# EAGLE design current_loop3 (EAGLE 6.6.0)
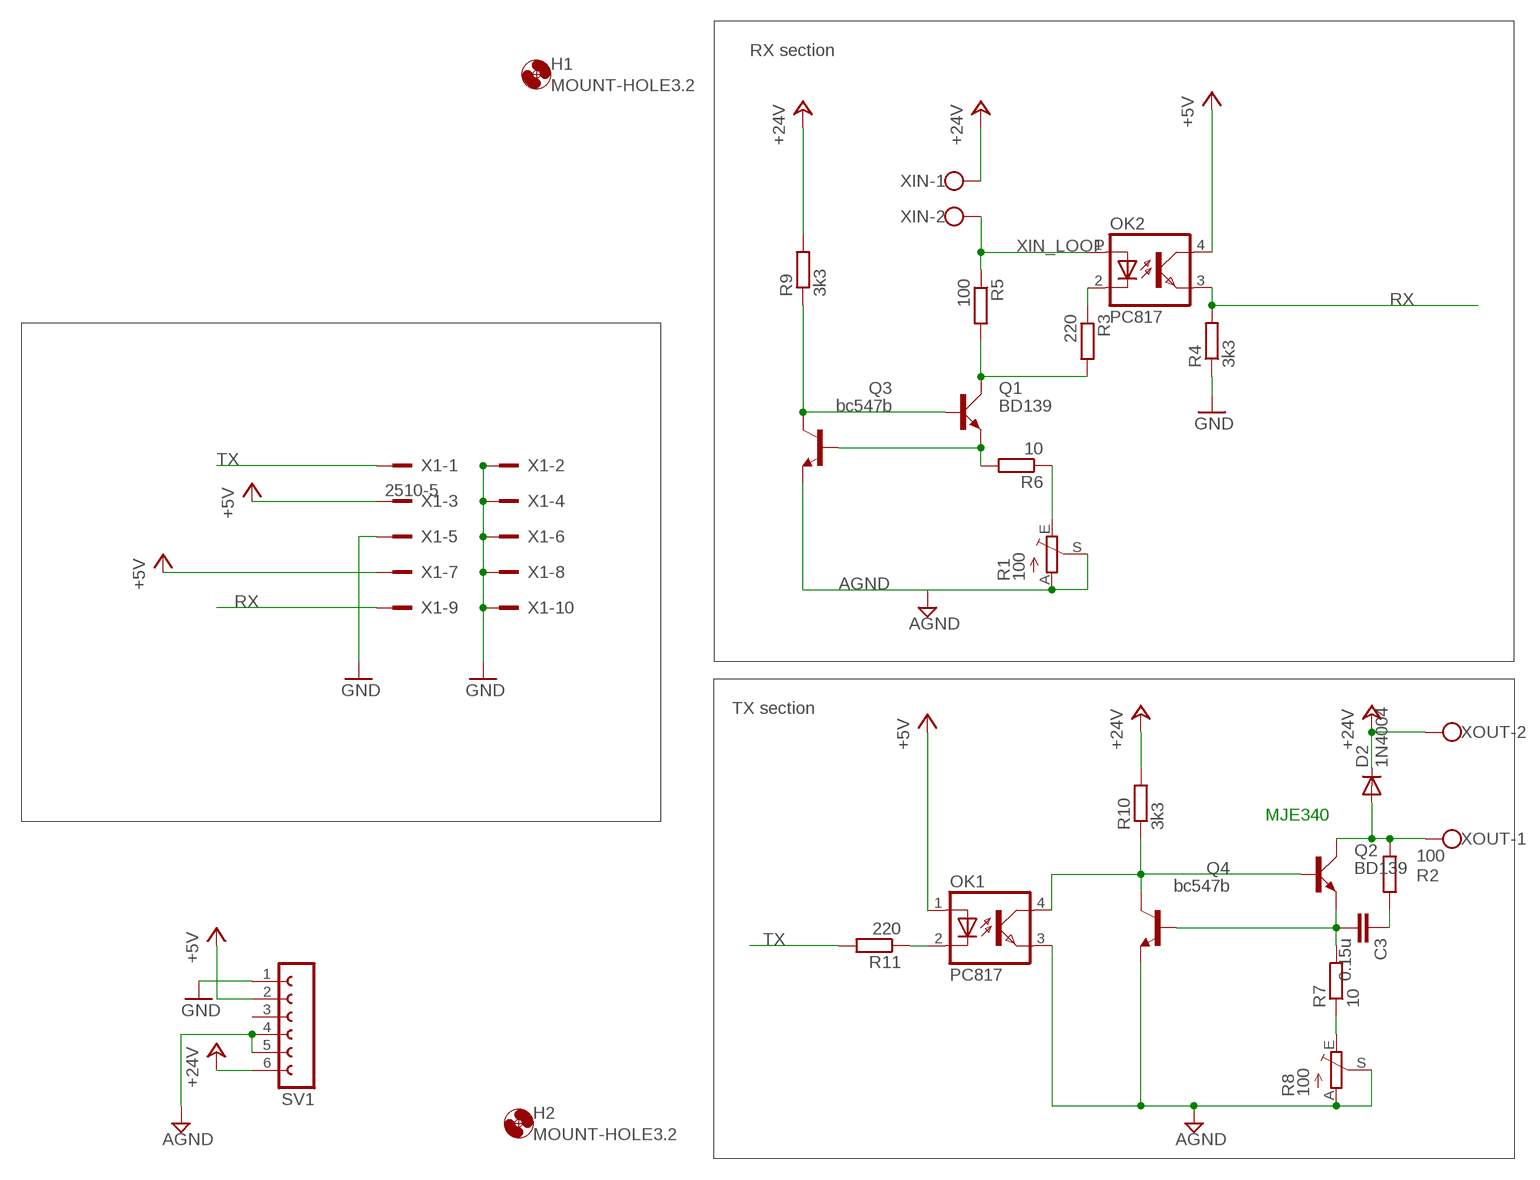
[diagram p0: schematic, sheet 1]

## Parts
C3  0.15u  C-EU075-063X106  [C075-063X106]
D2  1N4004  [DO41-10]
H1  MOUNT-HOLE3.2  [3,2]
H2  MOUNT-HOLE3.2  [3,2]
OK1  PC817  [DIL04]
OK2  PC817  [DIL04]
Q1  BD139  [TO126AV]
Q2  BD139  [TO126AV]
Q3  bc547b  BC547B-NPN-TO92-CBE  [TO92-CBE]
Q4  bc547b  BC547B-NPN-TO92-CBE  [TO92-CBE]
R1  100  TRIM_EU-CA14H  [CA14H]
R2  100  R-EU_0204/2V  [0204V]
R3  220  R-EU_0204/2V  [0204V]
R4  3k3  R-EU_0204/2V  [0204V]
R5  100  R-EU_0204/2V  [0204V]
R6  10  R-EU_0204/7  [0204/7]
R7  10  R-EU_0204/2V  [0204V]
R8  100  TRIM_EU-CA14H  [CA14H]
R9  3k3  R-EU_0204/7  [0204/7]
R10  3k3  R-EU_0204/2V  [0204V]
R11  220  R-EU_0204/2V  [0204V]
SV1  FE06-1  [FE06]
X1  2510-5  [PAK100/2500-5-10]
XIN  W237-102  [W237-102]
XOUT  W237-102  [W237-102]

## Nets
+5V: OK1.1(A) OK2.4(COL) SV1.2 X1.3 X1.7
+24V: D2.C R9.2 R10.2 SV1.6 XIN.1 XOUT.2
AGND: OK1.3(EMIT) Q3.E Q4.E R1.A R1.S R8.A R8.S SV1.4 SV1.5
GND: R4.1 SV1.1 X1.2 X1.4 X1.5 X1.6 X1.8 X1.10
N$1: Q1.C R3.2 R5.2
N$2: R7.1 R8.E
N$3: R1.E R6.1
N$4: C3.1 R2.1
N$9: OK2.2(C) R3.1
N$15: OK1.2(C) R11.1
N$16: D2.A Q2.C R2.2 XOUT.1
N$19: Q1.E Q3.B R6.2
N$20: OK1.4(COL) Q2.B Q4.C R10.1
N$24: C3.2 Q2.E Q4.B R7.2
N$25: Q1.B Q3.C R9.1
RX: OK2.3(EMIT) R4.2 X1.9
TX: R11.2 X1.1
XIN_LOOP: OK2.1(A) R5.1 XIN.2
Unconnected: SV1.3

## Notes on the sheet
- RX section
- TX section
- MJE340

## Library data of the parts
C3 = rcl:C-EU: CAPACITOR, European symbol
D2 = diode:1N4004: DIODE general purpose rectifier, 1 A
H1 H2 = holes:MOUNT-HOLE: MOUNTING HOLE with drill center marker
OK1 OK2 = optocoupler:PC817: SHARP OPTO COUPLER; MPN: PC817X4J000F; OC_FARNELL: 9707727; OC_NEWARK: 97K7059
Q1 Q2 = transistor-power:BD139: NPN TRANSISTOR
Q3 Q4 = transistor:*-NPN-: NPN Transistror BF959 corrected 2008.03.06
R1 R8 = pot:TRIM_EU-: POTENTIOMETER
R2-R7 R9-R11 = rcl:R-EU_: RESISTOR, European symbol
SV1 = con-lsta:FE06-1: FEMALE HEADER; OC_FARNELL: unknown; OC_NEWARK: unknown
X1 = con-3m:2510-: 3M (TM) Pak 100 4-Wall Header Source: 3M; OC_FARNELL: 1788669; OC_NEWARK: unknown
XIN XOUT = con-wago-500:W237-102: WAGO SCREW CLAMP; MPN: 237-102; OC_FARNELL: unknown; OC_NEWARK: 70K9898

## Board
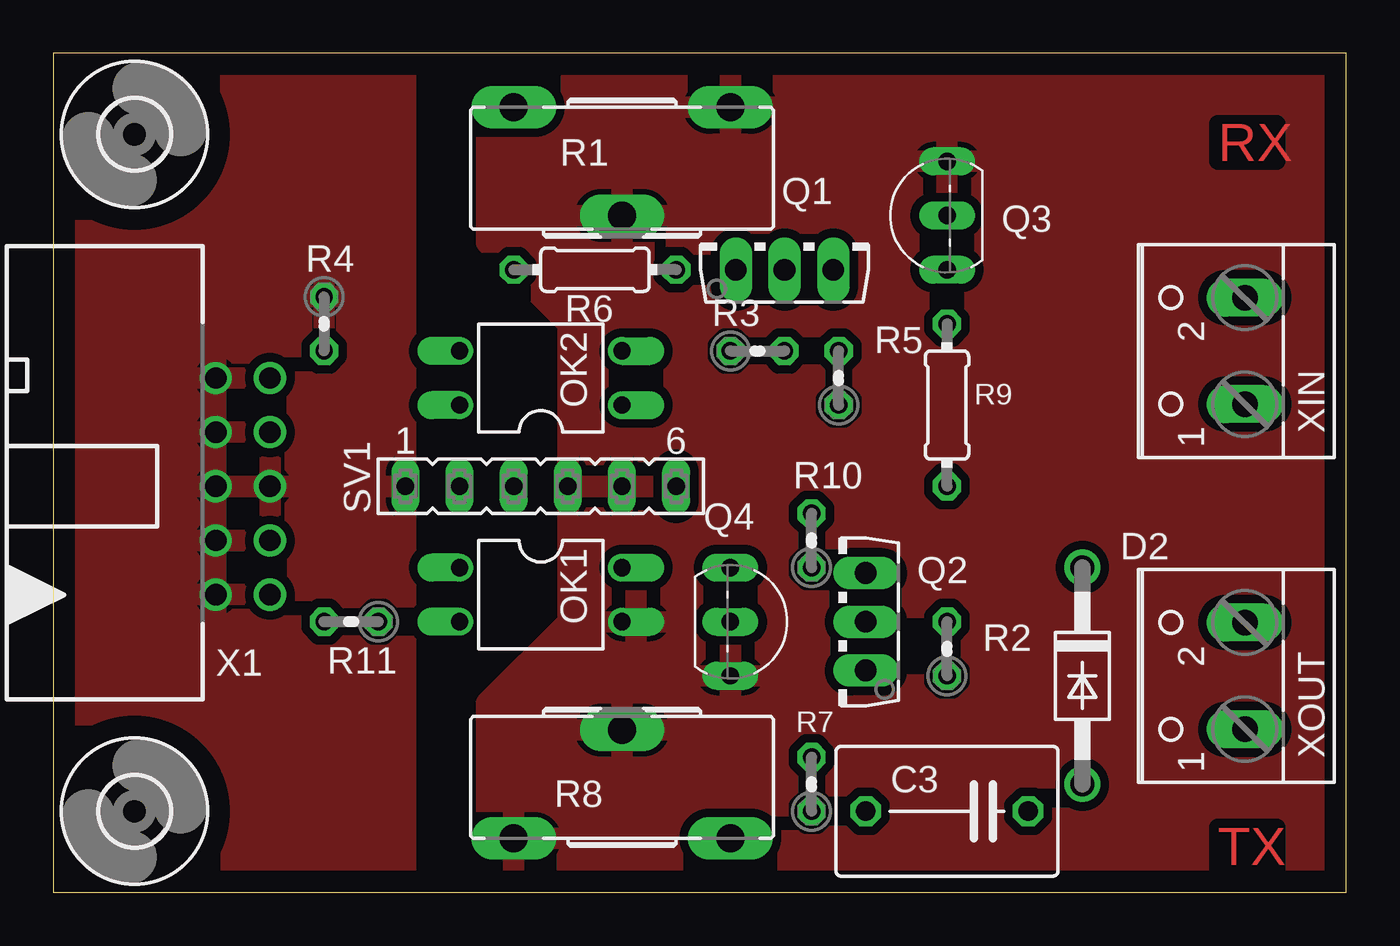
[diagram p1: board, top side]
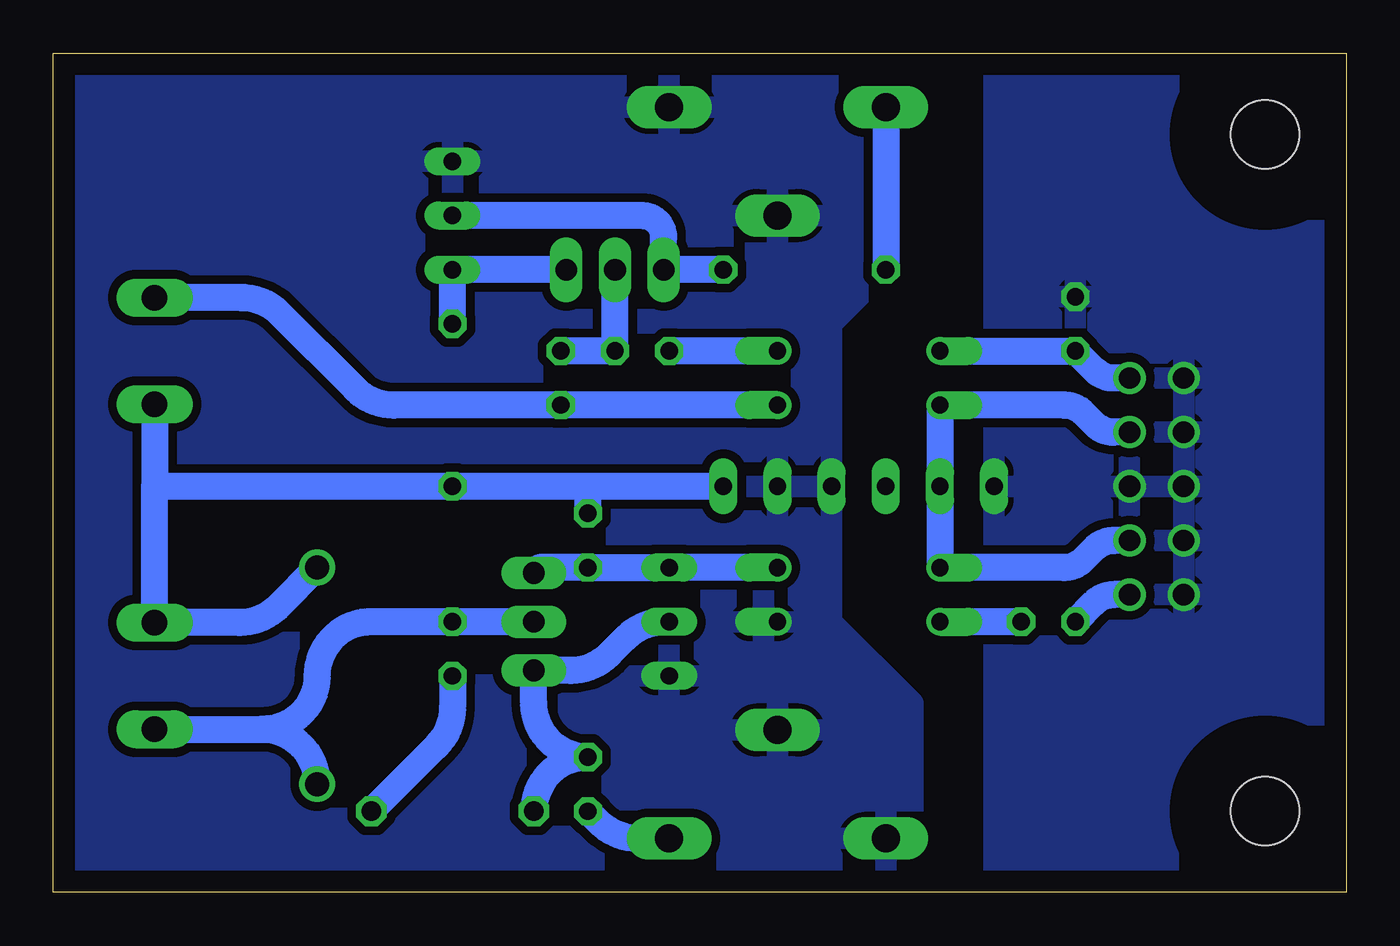
[diagram p2: board, bottom side, seen from below]

Size 60.63 x 39.36 mm. Coordinates in mm from the lower left corner, seen from the top.
Outline: 0,0 60.63,0 60.63,39.36 0,39.36 0,0
Copper layers (1*16): Top 0.035mm / dielectric 1.5mm / Bottom 0.035mm
Design rules "default": minimum track width 10mil, minimum drill 24mil, track to track 8mil, track to pad 8mil, pad to pad 8mil, via to via 8mil, smd to smd 8mil, copper to edge 40mil, drill to drill 8mil, minimum pad ring 10mil, minimum via ring 8mil, stop-mask expansion 4mil, vias tented up to drill 0mil, thermal gap 10mil

### Footprints (pad centres in the part's own frame; a part is rotated, then mirrored left to right if it is on the bottom)
C075-063X106 = drill 0.914 octagon: 1 -3.81,0; 2 3.81,0
DO41-10 = drill 1.118: A 5.08,0; C -5.08,0
3,2 = hole 3.2: 0,0
DIL04 = drill 0.813 offset: 1 -1.27,-3.81; 2 1.27,-3.81; 3 1.27,3.81; 4 -1.27,3.81
TO126AV = drill 1.016 long: B 2.286,-1.27; C 0,-1.27; E -2.286,-1.27
TO92-CBE = drill 0.813 long: B 0,0; C -2.54,0; E 2.54,0
CA14H = drill 1.321 long: A -5.08,0; E 5.08,0; S 0,5.08
0204V = drill 0.813 octagon: 1 -1.27,0; 2 1.27,0
0204/7 = drill 0.813 octagon: 1 -3.81,0; 2 3.81,0
FE06 = drill 0.813 long: 1 -6.35,0; 2 -3.81,0; 3 -1.27,0; 4 1.27,0; 5 3.81,0; 6 6.35,0
PAK100/2500-5-10 = drill 1 pad 1.422: 1 -5.08,-1.27; 2 -5.08,1.27; 3 -2.54,-1.27; 4 -2.54,1.27; 5 0,-1.27; 6 0,1.27; 7 2.54,-1.27; 8 2.54,1.27; 9 5.08,-1.27; 10 5.08,1.27
W237-102 = drill 1.194 long: 1 -2.5,-1.27; 2 2.5,-1.27

### Placement (x,y rotation side)
C3  41.91,3.81 180 top
D2  48.26,10.16 270 top
H1  3.81,3.81 0 top
H2  3.81,35.56 0 top
OK1  22.86,13.97 270 top
OK2  22.86,24.13 90 top
Q1  34.29,30.48 0 top
Q2  36.83,12.7 90 top
Q3  41.91,31.75 90 top
Q4  31.75,12.7 270 top
R1  26.67,36.83 180 top
R2  41.91,11.43 90 top
R3  33.02,25.4 0 top
R4  12.7,26.67 270 top
R5  36.83,24.13 90 top
R6  25.4,29.21 0 top
R7  35.56,5.08 90 top
R8  26.67,2.54 0 top
R9  41.91,22.86 270 top
R10  35.56,16.51 90 top
R11  13.97,12.7 180 top
SV1  22.86,19.05 0 top
X1  8.89,19.05 90 top
XIN  54.61,25.4 90 top
XOUT  54.61,10.16 90 top

### Tracks (layer width: path | path; a pad name or v marks a point on that pad's centre or on a via)
+5V
  Bottom 1.27: X1.7 10.9,21.59 arc45 11.8,21.96 12.33,22.49 arc-45 13.23,22.86 OK2.4 SV1.2 OK1.1 13.23,15.24 arc-45 12.33,15.61 11.8,16.14 arc45 10.9,16.51 X1.3
+24V
  Bottom 1.27: 55.88,19.05 R9.2 35.56,19.05 | XIN.1 55.88,19.05 | 55.88,19.05 XOUT.2 51.89,12.66 arc-45 50.1,13.4 D2.C | SV1.6 35.56,19.05 | R10.2 35.56,19.05
AGND
  pour Bottom (isolate 0.406): 20.32,39.37 20.32,30.48 24.13,26.67 24.13,12.7 20.32,8.89 20.32,0 60.96,0 60.96,39.37
  pour Top (isolate 0.406): 20.32,0 20.32,8.89 24.13,12.7 24.13,26.67 20.32,30.48 20.32,39.37 60.96,39.37 60.96,0
GND
  pour Bottom (isolate 0.406): 0,0 0,39.37 16.51,39.37 16.51,0
  pour Top (isolate 0.406): 0,39.37 16.51,39.37 16.51,0 0,0
N$1
  Bottom 1.27: R5.2 R3.2 Q1.C
N$2
  Bottom 1.27: R8.E 33.24,2.54 arc45 35.03,3.28 R7.1
N$3
  Bottom 1.27: R1.E R6.1
N$4
  Bottom 1.27: R2.1 41.91,8.67 arc45 42.65,6.88 C3.1
N$9
  Bottom 1.27: OK2.2 R3.1
N$15
  Bottom 1.27: R11.1 OK1.2
N$16
  Bottom 1.27: Q2.C R2.2 45.72,12.7 arc-90 48.26,10.16 arc92 50.84,7.66 | XOUT.1 50.84,7.66 | 50.84,7.66 arc90 D2.A
N$19
  Bottom 1.27: R6.2 Q1.E 32,30.73 arc-90 33.02,31.75 Q3.B
N$20
  Bottom 1.27: OK1.4 Q4.C R10.1 37.85,15.24 Q2.B
N$24
  Bottom 1.27: Q4.B 31.97,12.7 arc-45 33.76,11.96 34.56,11.16 arc45 36.36,10.41 Q2.E 38.1,8.89 arc-90 R7.2 arc-90 C3.2
N$25
  Bottom 1.27: Q1.B Q3.C R9.1
RX
  Bottom 1.27: OK2.3 R4.2 11.8,24.5 arc-45 10.9,24.13 X1.9
TX
  Bottom 1.27: X1.1 10.9,13.97 arc-45 11.8,13.6 R11.2
XIN_LOOP
  Bottom 1.016: 55.88,27.94 XIN.2
  Bottom 1.27: OK2.1 R5.1 44.67,22.86 arc45 46.46,23.6 50.02,27.16 arc-45 51.81,27.9 XIN.2

### Text on the board
Top: RX | TX